# EAGLE design midicv (EAGLE 7.2.0)
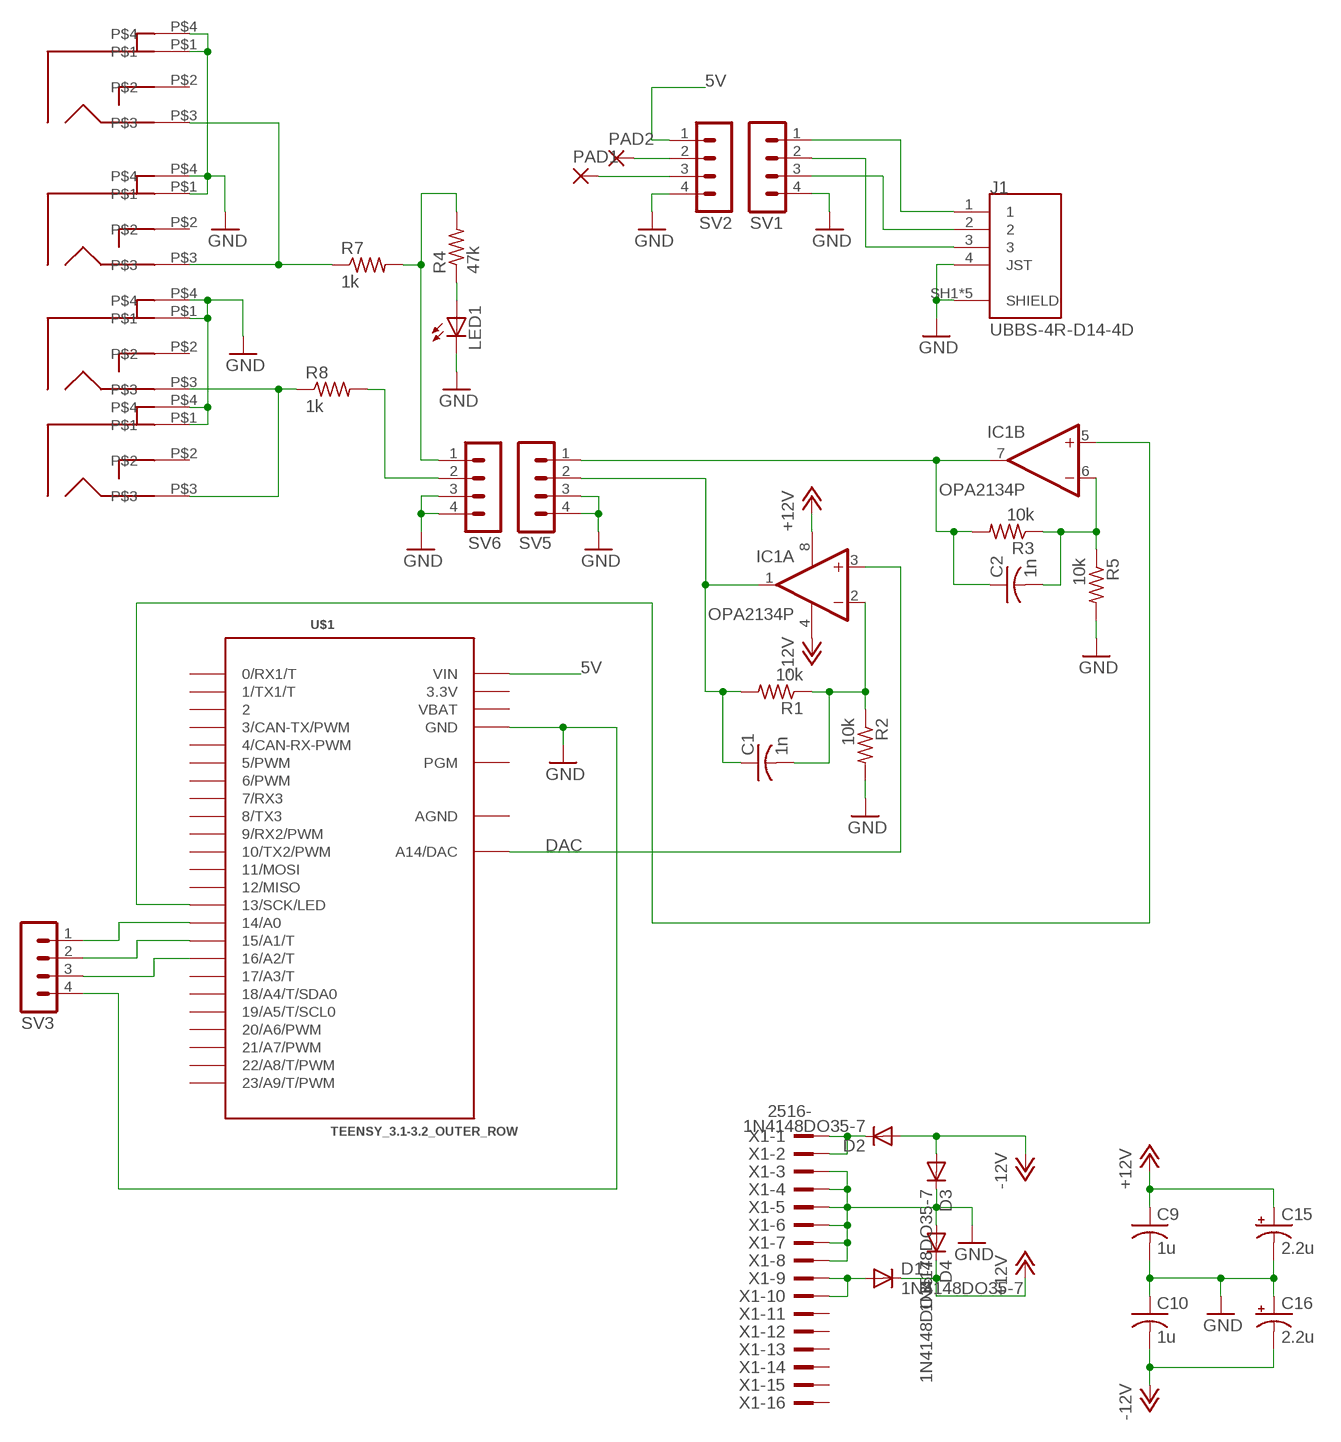
[diagram p0: schematic, sheet 1]

## Parts
C1  1n  C-US050-025X075  [C050-025X075]
C2  1n  C-US050-025X075  [C050-025X075]
C9  1u  C-US050-025X075  [C050-025X075]
C10  1u  C-US050-025X075  [C050-025X075]
C15  2.2u  CPOL-USE2.5-6  [E2,5-6]
C16  2.2u  CPOL-USE2.5-6  [E2,5-6]
CV  PJ301BM  [PJ301BM]
CV1  PJ301BM  [PJ301BM]
D1  1N4148DO35-7  [DO35-7]
D2  1N4148DO35-7  [DO35-7]
D3  1N4148DO35-7  [DO35-7]
D4  1N4148DO35-7  [DO35-7]
GATE  PJ301BM  [PJ301BM]
GATE1  PJ301BM  [PJ301BM]
IC1  OPA2134P  [DIL08]
J1  UBBS-4R-D14-4D  [JST_UBBS-4R-D14-4D]
LED1  LED5MM  [LED5MM]
PAD1  2,0/0,9-R  [2,0/0,9-R]
PAD2  2,0/0,9-R  [2,0/0,9-R]
R1  10k  R-US_0207/2V  [0207/2V]
R2  10k  R-US_0207/2V  [0207/2V]
R3  10k  R-US_0207/2V  [0207/2V]
R4  47k  R-US_0207/7  [0207/7]
R5  10k  R-US_0207/2V  [0207/2V]
R7  1k  R-US_0207/7  [0207/7]
R8  1k  R-US_0207/7  [0207/7]
SV1  MA04-1  [MA04-1]
SV2  MA04-1  [MA04-1]
SV3  MA04-1  [MA04-1]
SV5  MA04-1  [MA04-1]
SV6  MA04-1  [MA04-1]
U$1  TEENSY_3.1-3.2_OUTER_ROW  [TEENSY_3.0-3.2&LC_OUTER_ROW]
X1  2516-  [PAK100/2500-16]

## Nets
5V: SV2.1 U$1.VIN
+12V: C9.1 C15.+ D1.C D4.C IC1.8(P:V+)
-12V: C10.2 C16.- D2.A D3.A IC1.4(P:V-)
DAC: IC1.3(A:+IN) U$1.RESET/DAC(A14/DAC)
GND: C9.2 C10.1 C15.- C16.+ CV1.P$1 CV1.P$4 CV.P$1 CV.P$4 D3.C D4.A GATE1.P$1 GATE1.P$4 GATE.P$1 GATE.P$4 J1.4(JST) J1.SH1(SHIELD) J1.SH2(SHIELD) J1.SH3(SHIELD) J1.SH4(SHIELD) J1.SH5(SHIELD) LED1.K(C) R2.2 R5.2 SV1.4 SV2.4 SV3.4 SV5.3 SV5.4 SV6.3 SV6.4 U$1.GND U$1.GND1(GND) X1.3 X1.4 X1.5 X1.6 X1.7 X1.8
N$1: C1.1 IC1.1(A:OUT) R1.2 SV5.2
N$2: C2.1 IC1.7(B:OUT) R3.2 SV5.1
N$3: SV3.1 U$1.14/A0
N$4: IC1.5(B:+IN) U$1.13(13/SCK/LED)
N$5: C1.2 IC1.2(A:-IN) R1.1 R2.1
N$6: PAD2.1(P) SV2.2
N$7: LED1.A R4.1
N$8: PAD1.1(P) SV2.3
N$10: C2.2 IC1.6(B:-IN) R3.1 R5.1
N$11: J1.3 SV1.2
N$12: J1.1 SV1.1
N$13: SV3.2 U$1.15/A1(15/A1/T)
N$14: GATE1.P$3 GATE.P$3 R7.1
N$15: CV1.P$3 CV.P$3 R8.1
N$16: SV3.3 U$1.16/A2(16/A2/T)
N$18: J1.2 SV1.3
N$26: R4.2 R7.2 SV6.1
N$43: D2.C X1.1 X1.2
N$45: D1.A X1.9 X1.10
N$49: R8.2 SV6.2
Unconnected: CV1.P$2 CV.P$2 GATE1.P$2 GATE.P$2 U$1.0(0/RX1/T) U$1.1(1/TX1/T) U$1.2 U$1.3(3/CAN-TX/PWM) U$1.4(4/CAN-RX-PWM) U$1.5(5/PWM) U$1.6(6/PWM) U$1.7(7/RX3) U$1.8(8/TX3) U$1.9(9/RX2/PWM) U$1.10(10/TX2/PWM) U$1.11(11/MOSI) U$1.12(12/MISO) U$1.17/A3(17/A3/T) U$1.18/A4(18/A4/T/SDA0) U$1.19/A5(19/A5/T/SCL0) U$1.20/A6(20/A6/PWM) U$1.21/A7(21/A7/PWM) U$1.22/A8(22/A8/T/PWM) U$1.23/A9(23/A9/T/PWM) U$1.PGM X1.11 X1.12 X1.13 X1.14 X1.15 X1.16

## Power pins joined to a net without a drawn wire
3.3V: U$1.3.3V U$1.3.3V1(3.3V)
AGND: U$1.AGND
VBAT: U$1.VBAT

## Library data of the parts
C1 C2 C9 C10 = dan:C-US: CAPACITOR, American symbol
C15 C16 = dan:CPOL-US: POLARIZED CAPACITOR, American symbol
CV CV1 GATE GATE1 = dan:PJ301BM
D1-D4 = dan:1N4148: DIODE high speed (Philips)
IC1 = dan:OPA2134: SoundPLUS (TM) High Performance AUDIO OPERATIONAL AMPLIFIERS Source: http://focus.ti.com/lit/ds/sbos058/sbos058.pdf
J1 = UBBS-4R-D14-4D:UBBS-4R-D14-4D: Socket; USB B; on PCBs; THT; PIN: 4; straight; V: USB 2.0; AVAILABILITY: Unavailable; DESCRIPTION: Socket; USB B; on PCBs; THT; PIN: 4; straight; V: USB 2.0; MF: JST; MP: UBBS-4R-D14-4D; PACKAGE: None; PRICE: None
LED1 = dan:LED: LED OSRAM: - CHIPLED LG R971, LG N971, LY N971, LG Q971, LY Q971, LO R971, LY R971 LH N974, LH R974 LS Q976, LO Q976, LY Q976 LO Q996 - Hyper CHIPLED LW Q18S LB Q993, LB Q99A, LB R99A - SideLED LS A670, LO A670, LY A670, LG A670, LP A670 LB A673, LV A673, LT A673, LW A673 LH A674 LY A675 LS A676, LA A676, LO A676, LY A676, LW A676 LS A679, LY A679, LG A679 - Hyper Micro SIDELED® LS Y876, LA Y876, LO Y876, LY Y876 LT Y87S - SmartLED LW L88C, LW L88S LB L89C, LB L89S, LG L890 LS L89K, LO L89K, LY L89K LS L896, LA L896, LO L896, LY L896 - TOPLED LS T670, LO T670, LY T670, LG T670, LP T670 LSG T670, LSP T670, LSY T670, LOP T670, LYG T670 LG T671, LOG T671, LSG T671 LB T673, LV T673, LT T673, LW T673 LH T674 LS T676, LA T676, LO T676, LY T676, LB T676, LH T676, LSB T676, LW T676 LB T67C, LV T67C, LT T67C, LS T67K, LO T67K, LY T67K, LW E67C LS E67B, LA E67B, LO E67B, LY E67B, LB E67C, LV E67C, LT E67C LW T67C LS T679, LY T679, LG T679 LS T770, LO T770, LY T770, LG T770, LP T770 LB T773, LV T773, LT T773, LW T773 LH T774 LS E675, LA E675, LY E675, LS T675 LS T776, LA T776, LO T776, LY T776, LB T776 LHGB T686 LT T68C, LB T68C - Hyper Mini TOPLED® LB M676 - Mini TOPLED Santana® LG M470 LS M47K, LO M47K, LY M47K Source: http://www.osram.convergy.de LUXEON: - LUMILED® LXK2-PW12-R00, LXK2-PW12-S00, LXK2-PW14-U00, LXK2-PW14-V00 LXK2-PM12-R00, LXK2-PM12-S00, LXK2-PM14-U00 LXK2-PE12-Q00, LXK2-PE12-R00, LXK2-PE12-S00, LXK2-PE14-T00, LXK2-PE14-U00 LXK2-PB12-K00, LXK2-PB12-L00, LXK2-PB12-M00, LXK2-PB14-N00, LXK2-PB14-P00, LXK2-PB14-Q00 LXK2-PR12-L00, LXK2-PR12-M00, LXK2-PR14-Q00, LXK2-PR14-R00 LXK2-PD12-Q00, LXK2-PD12-R00, LXK2-PD12-S00 LXK2-PH12-R00, LXK2-PH12-S00 LXK2-PL12-P00, LXK2-PL12-Q00, LXK2-PL12-R00 Source: www.luxeon.com KINGBRIGHT: KA-3528ASYC Source: www.kingbright.com
PAD1 PAD2 = synthdiy:2,0/0,9-R: ROUND THROUGH-HOLE PAD 2.0 mm, 0.9 mm/0.079",0.035"
R1-R5 R7 R8 = dan:R-US_: RESISTOR, American symbol
SV1-SV3 SV5 SV6 = dan:MA04-1: PIN HEADER; OC_FARNELL: unknown; OC_NEWARK: unknown
U$1 = Teensy_3_and_LC_Series_Boards_v1.4:TEENSY_3.1-3.2_OUTER_ROW: Footprint for Teensy 3.1 or 3.2 board using all pin connections on the outer perimeter
X1 = dan:2516-: 3M (TM) Pak 100 4-Wall Header Source: 3M; OC_FARNELL: unknown; OC_NEWARK: unknown

## Board
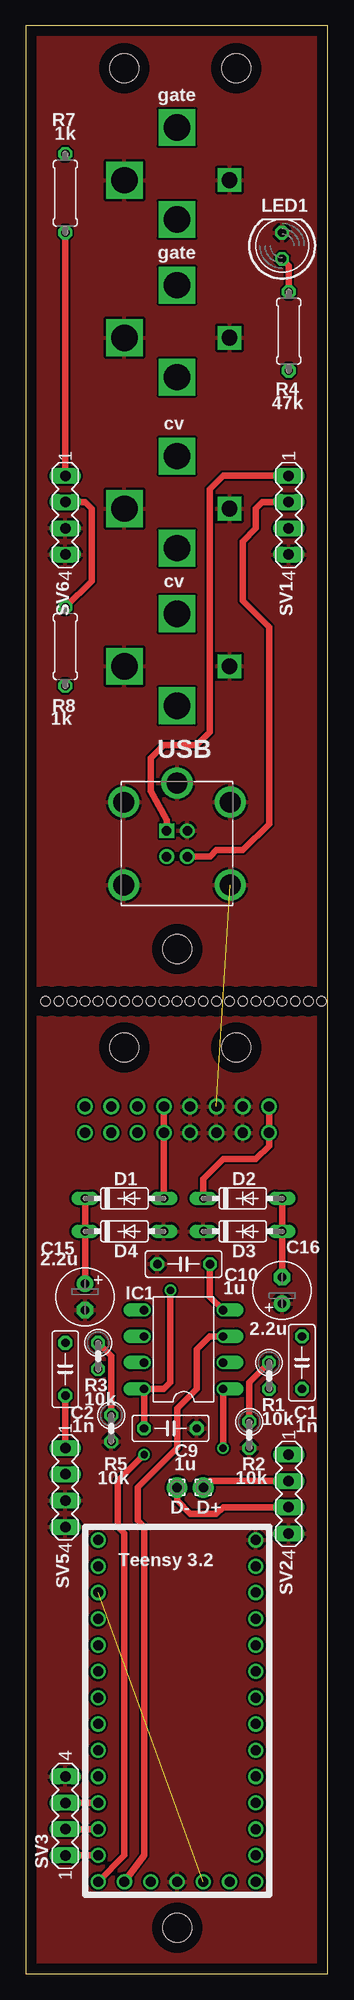
[diagram p1: board, top side]
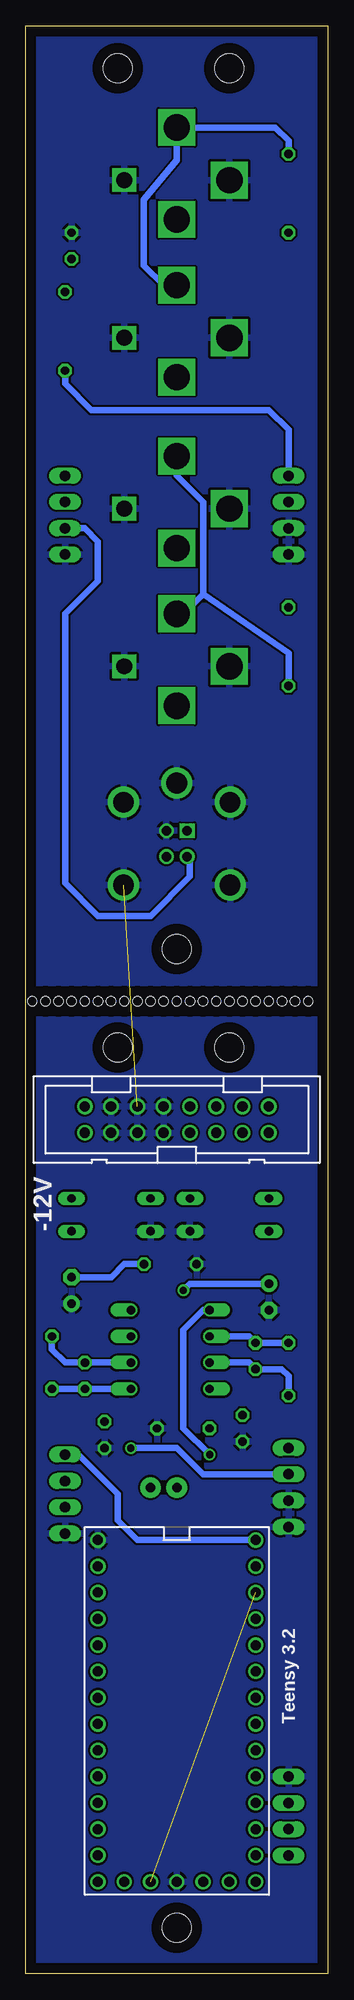
[diagram p2: board, bottom side, seen from below]

Size 29.19 x 188.26 mm. Coordinates in mm from the lower left corner, seen from the top.
Outline: 0,0 29.19,0 29.19,188.26 0,188.26 0,0
Copper layers (1*16): Top 0.035mm / dielectric 1.5mm / Bottom 0.035mm
Design rules "default": minimum track width 10mil, minimum drill 24mil, track to track 8mil, track to pad 8mil, pad to pad 8mil, via to via 8mil, smd to smd 8mil, copper to edge 40mil, drill to drill 8mil, minimum pad ring 10mil, minimum via ring 8mil, stop-mask expansion 4mil, vias tented up to drill 0mil, thermal gap 10mil
Holes 0.9 mm at 10.79,93.98 9.53,93.98 8.26,93.98 6.99,93.98 5.71,93.98 4.45,93.98 3.17,93.98 1.91,93.98 12.06,93.98 13.34,93.98 14.61,93.98 15.88,93.98 26.04,93.98 24.77,93.98 23.5,93.98 22.23,93.98 20.95,93.98 19.68,93.98 18.41,93.98 17.14,93.98 27.3,93.98 28.57,93.98
Holes 2.8 mm at 9.53,184.15 20.32,184.15 9.53,89.53 20.32,89.53 14.61,4.45 14.61,99.06

### Footprints (pad centres in the part's own frame; a part is rotated, then mirrored left to right if it is on the bottom)
C050-025X075 = drill 0.813 octagon: 1 -2.54,0; 2 2.54,0
E2,5-6 = drill 0.813 pad 1.6: + -1.27,0 | drill 0.813 pad 1.6 octagon: - 1.27,0
PJ301BM = drill 1.524 square: P$1 5.08,0 | drill 2.54 square: P$2 0,-3.81; P$3 0,5.08; P$4 -5.08,0
DO35-7 = drill 0.813 long: A 3.81,0; C -3.81,0
DIL08 = drill 0.813 offset: 1 -3.81,-3.81; 2 -1.27,-3.81; 3 1.27,-3.81; 4 3.81,-3.81; 5 3.81,3.81; 6 1.27,3.81; 7 -1.27,3.81; 8 -3.81,3.81
JST_UBBS-4R-D14-4D = drill 0.92 square: 1 1.25,1 | drill 0.92: 2 -1.25,1; 3 -1.25,-1; 4 1.25,-1 | drill 2: SH1 -4,5.15; SH2 -4,-5.15; SH3 4,-5.15; SH4 4,5.15; SH5 5.85,0
LED5MM = drill 0.813 octagon: A -1.27,0; K 1.27,0
2,0/0,9-R = drill 0.914 pad 2: 1 0,0
0207/2V = drill 0.813 octagon: 1 -1.27,0; 2 1.27,0
0207/7 = drill 0.813 octagon: 1 -3.81,0; 2 3.81,0
MA04-1 = drill 1.016 long: 1 -3.81,0; 2 -1.27,0; 3 1.27,0; 4 3.81,0
TEENSY_3.0-3.2&LC_OUTER_ROW = drill 0.965: 0 -7.62,13.97; 1 -7.62,11.43; 2 -7.62,8.89; 3 -7.62,6.35; 3.3V 7.62,11.43; 3.3V1 -2.54,-16.51; 4 -7.62,3.81; 5 -7.62,1.27; 6 -7.62,-1.27; 7 -7.62,-3.81; 8 -7.62,-6.35; 9 -7.62,-8.89; 10 -7.62,-11.43; 11 -7.62,-13.97; 12 -7.62,-16.51; 13 7.62,-16.51; 14/A0 7.62,-13.97; 15/A1 7.62,-11.43; 16/A2 7.62,-8.89; 17/A3 7.62,-6.35; 18/A4 7.62,-3.81; 19/A5 7.62,-1.27; 20/A6 7.62,1.27; 21/A7 7.62,3.81; 22/A8 7.62,6.35; 23/A9 7.62,8.89; AGND 7.62,13.97; GND -7.62,16.51; GND1 0,-16.51; PGM 2.54,-16.51; RESET/DAC 5.08,-16.51; VBAT -5.08,-16.51; VIN 7.62,16.51
PAK100/2500-16 = drill 1 pad 1.422: 1 -8.89,-1.27; 2 -8.89,1.27; 3 -6.35,-1.27; 4 -6.35,1.27; 5 -3.81,-1.27; 6 -3.81,1.27; 7 -1.27,-1.27; 8 -1.27,1.27; 9 1.27,-1.27; 10 1.27,1.27; 11 3.81,-1.27; 12 3.81,1.27; 13 6.35,-1.27; 14 6.35,1.27; 15 8.89,-1.27; 16 8.89,1.27

### Placement (x,y rotation side)
C1  26.67,59.05 90 top
C2  3.81,58.42 90 top
C9  13.97,52.7 0 top
C10  15.24,68.58 0 top
C15  5.71,65.41 270 top
C16  24.77,66.04 90 top
CV  14.61,141.6 0 top
CV1  14.61,126.36 0 top
D1  9.53,74.93 0 top
D2  20.95,74.93 0 top
D3  20.95,71.75 0 top
D4  9.53,71.75 0 top
GATE  14.61,173.35 0 top
GATE1  14.61,158.12 0 top
IC1  15.24,60.33 90 top
J1  14.61,109.22 90 top
LED1  24.77,167 90 top
PAD1  14.61,46.99 0 top
PAD2  17.14,46.99 0 top
R1  23.5,57.78 270 top
R2  21.59,52.07 270 top
R3  6.99,59.69 270 top
R4  25.4,158.75 270 top
R5  8.26,52.7 270 top
R7  3.81,172.09 270 top
R8  3.81,128.27 90 top
SV1  25.4,140.97 270 top
SV2  25.4,46.35 270 top
SV3  3.81,15.24 90 top
SV5  3.81,46.99 270 top
SV6  3.81,140.97 270 top
U$1  14.61,25.4 0 bottom
X1  14.61,82.55 0 bottom

### Tracks (layer width: path | path; a pad name or v marks a point on that pad's centre or on a via)
3.3V  (1 unrouted)
5V
  Bottom 0.61: SV2.1 24.13,50.16 20.32,46.35 20.32,43.81 18.41,41.91 U$1.VIN
+12V  (via drill 0.7)
  Top 0.61: D1.C D4.C C15.+ | C9.1 IC1.8 13.34,56.52 13.97,57.15 v13.97,66.04
  Bottom 0.61: C15.+ 13.34,66.67 v13.97,66.04
-12V
  Top 0.61: D2.A D3.A C16.- | IC1.4 17.78,65.41 C10.2
  Bottom 0.61: C16.- 20.95,67.31 19.68,68.58 C10.2
DAC
  Top 0.61: IC1.3 17.78,61.59 16.51,60.33 16.51,56.52 14.61,54.61 14.61,50.8 10.79,46.99 10.79,43.81 11.43,43.18 11.43,11.43 U$1.RESET/DAC
GND  (1 unrouted)
  pour Top: -1.91,190.5 31.11,190.5 31.75,-2.54 -1.91,-2.54
  pour Bottom: -1.27,189.87 30.48,189.87 31.11,-1.91 -1.27,-1.91
N$1  (via drill 0.7)
  Top 0.61: v19.05,50.8 IC1.1
  Bottom 0.61: C1.1 R1.2 IC1.1 | SV5.2 12.06,48.26 14.61,50.8 v19.05,50.8
N$2
  Top 0.61: SV5.1 C2.1
  Bottom 0.61: IC1.7 7.62,59.05 R3.2 4.45,58.42 3.81,57.78 C2.1
N$3
  Top 0.61: U$1.14/A0 SV3.1
N$4  (via drill 0.7)
  Top 0.61: v11.43,50.16 8.89,47.62 8.89,43.18 9.53,42.55 9.53,11.43 U$1.13
  Bottom 0.61: IC1.5 12.06,64.14 13.97,62.23 13.97,52.7 v11.43,50.16
N$5
  Top 0.61: R2.1 21.59,57.15 R1.1
  Bottom 0.61: IC1.2 R1.1 25.4,59.05 26.67,60.33 C1.2
N$6
  Top 0.61: SV2.2 17.78,47.62 PAD2.1
N$7
  Top 0.61: R4.1 25.4,165.1 LED1.A
N$8
  Top 0.61: PAD1.1 14.61,45.72 15.88,44.45 18.41,44.45 19.05,45.09 SV2.3
N$10
  Top 0.61: R5.1 8.26,59.69 R3.1
  Bottom 0.61: IC1.6 7.62,61.59 R3.1 C2.2
N$11
  Top 0.61: J1.3 17.8,107.97 18.41,108.58 20.95,108.58 23.5,111.12 23.5,130.18 20.95,132.72 20.95,138.43 22.23,139.7 22.23,141.6 22.86,142.24 SV1.2
N$12
  Top 0.61: J1.1 13.61,111.49 12.06,114.3 12.06,117.47 13.34,118.75 16.51,118.75 17.78,120.02 17.78,143.51 19.05,144.78 SV1.1
N$13
  Top 0.61: U$1.15/A1 SV3.2
N$14
  Bottom 0.61: R7.1 3.81,177.16 5.08,178.44 GATE.P$3 14.61,175.26 17.78,171.45 17.78,165.1 15.88,163.19 GATE1.P$3
N$15
  Bottom 0.61: R8.1 3.81,127.64 12.06,133.35 | 12.06,133.35 12.06,142.24 14.61,144.78 CV.P$3 | CV1.P$3 13.97,131.44 12.06,133.35
N$16
  Top 0.61: U$1.16/A2 SV3.3
N$18
  Bottom 0.61: SV1.3 23.5,139.7 22.23,138.43 22.23,134.62 25.4,131.44 25.4,105.41 22.23,102.23 17.14,102.23 13.34,106.05 13.34,107.7 J1.2
N$26
  Top 0.61: R7.2 SV6.1
  Bottom 0.61: SV6.1 3.81,149.22 5.71,151.13 22.86,151.13 25.4,153.67 R4.2
N$43
  Top 0.61: X1.2 X1.1 23.5,80.01 22.23,78.74 19.05,78.74 17.14,76.83 D2.C
N$45
  Top 0.61: X1.10 X1.9 D1.A
N$49
  Top 0.61: R8.2 6.35,134.62 6.35,141.6 5.71,142.24 SV6.2

### Text on the board
tPlace: gate | gate | cv | cv | USB | D- | D+ | Teensy 3.2
bPlace: -12V | Teensy 3.2